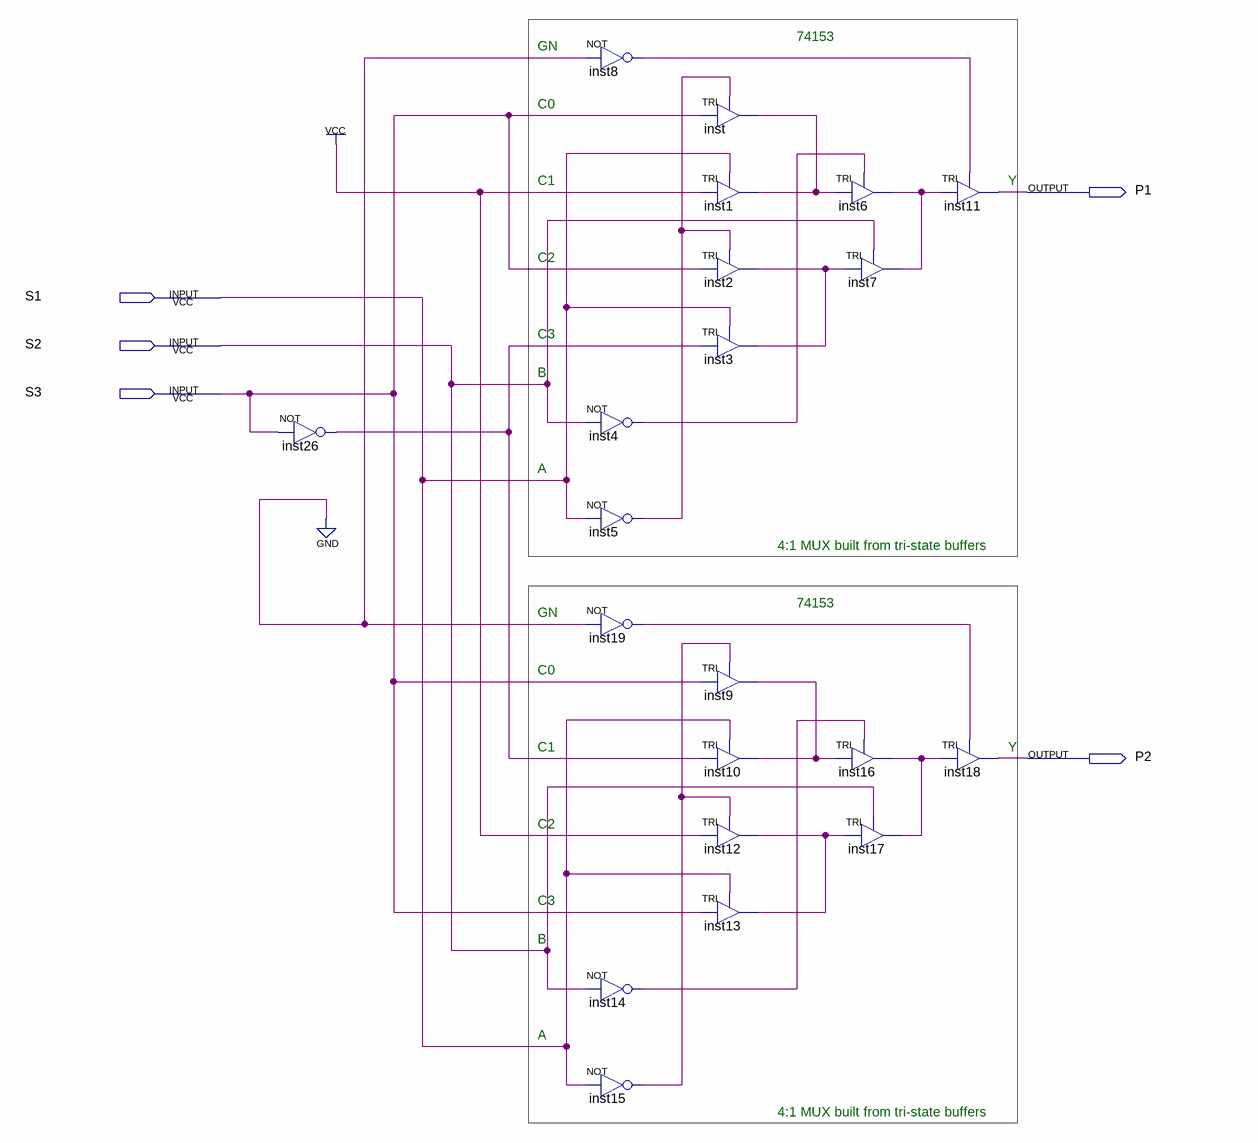
[diagram p0: schematic sheet]
// Quartus schematic Lab07.bdf as structural Verilog: 21 symbols, 5 pins
module Lab07 (
  input  S1,
  input  S2,
  input  S3,
  output P1,
  output P2
);

  wire inst2_out, inst4_out, inst5_out, inst6_out, inst8_out, inst9_out, inst12_out, inst14_out, inst15_out,
       inst16_out, inst19_out, inst26_out, inst_out;

  not inst26 (inst26_out, S3);
  not inst8 (inst8_out, 1'b0);
  not inst4 (inst4_out, S2);
  not inst5 (inst5_out, S1);
  not inst19 (inst19_out, 1'b0);
  not inst14 (inst14_out, S2);
  not inst15 (inst15_out, S1);
  TRI inst (.IN(S3), .OE(inst5_out), .OUT(inst_out));
  TRI inst1 (.IN(1'b1), .OE(S1), .OUT(inst_out));
  TRI inst2 (.IN(S3), .OE(inst5_out), .OUT(inst2_out));
  TRI inst3 (.IN(inst26_out), .OE(S1), .OUT(inst2_out));
  TRI inst9 (.IN(S3), .OE(inst15_out), .OUT(inst9_out));
  TRI inst10 (.IN(inst26_out), .OE(S1), .OUT(inst9_out));
  TRI inst12 (.IN(1'b1), .OE(inst15_out), .OUT(inst12_out));
  TRI inst13 (.IN(S3), .OE(S1), .OUT(inst12_out));
  TRI inst6 (.IN(inst_out), .OE(inst4_out), .OUT(inst6_out));
  TRI inst7 (.IN(inst2_out), .OE(S2), .OUT(inst6_out));
  TRI inst16 (.IN(inst9_out), .OE(inst14_out), .OUT(inst16_out));
  TRI inst17 (.IN(inst12_out), .OE(S2), .OUT(inst16_out));
  TRI inst11 (.IN(inst6_out), .OE(inst8_out), .OUT(P1));
  TRI inst18 (.IN(inst16_out), .OE(inst19_out), .OUT(P2));

  // Notes on the sheet:
  //   74153
  //   GN
  //   C0
  //   C1
  //   Y
  //   C2
  //   C3
  //   B
  //   A
  //   4:1 MUX built from tri-state buffers
  //   74153
  //   GN
  //   C0
  //   C1
  //   Y
  //   C2
  //   C3
  //   B
  //   A
  //   4:1 MUX built from tri-state buffers
endmodule
